# EAGLE schematic pihat (EAGLE 7.6.0)
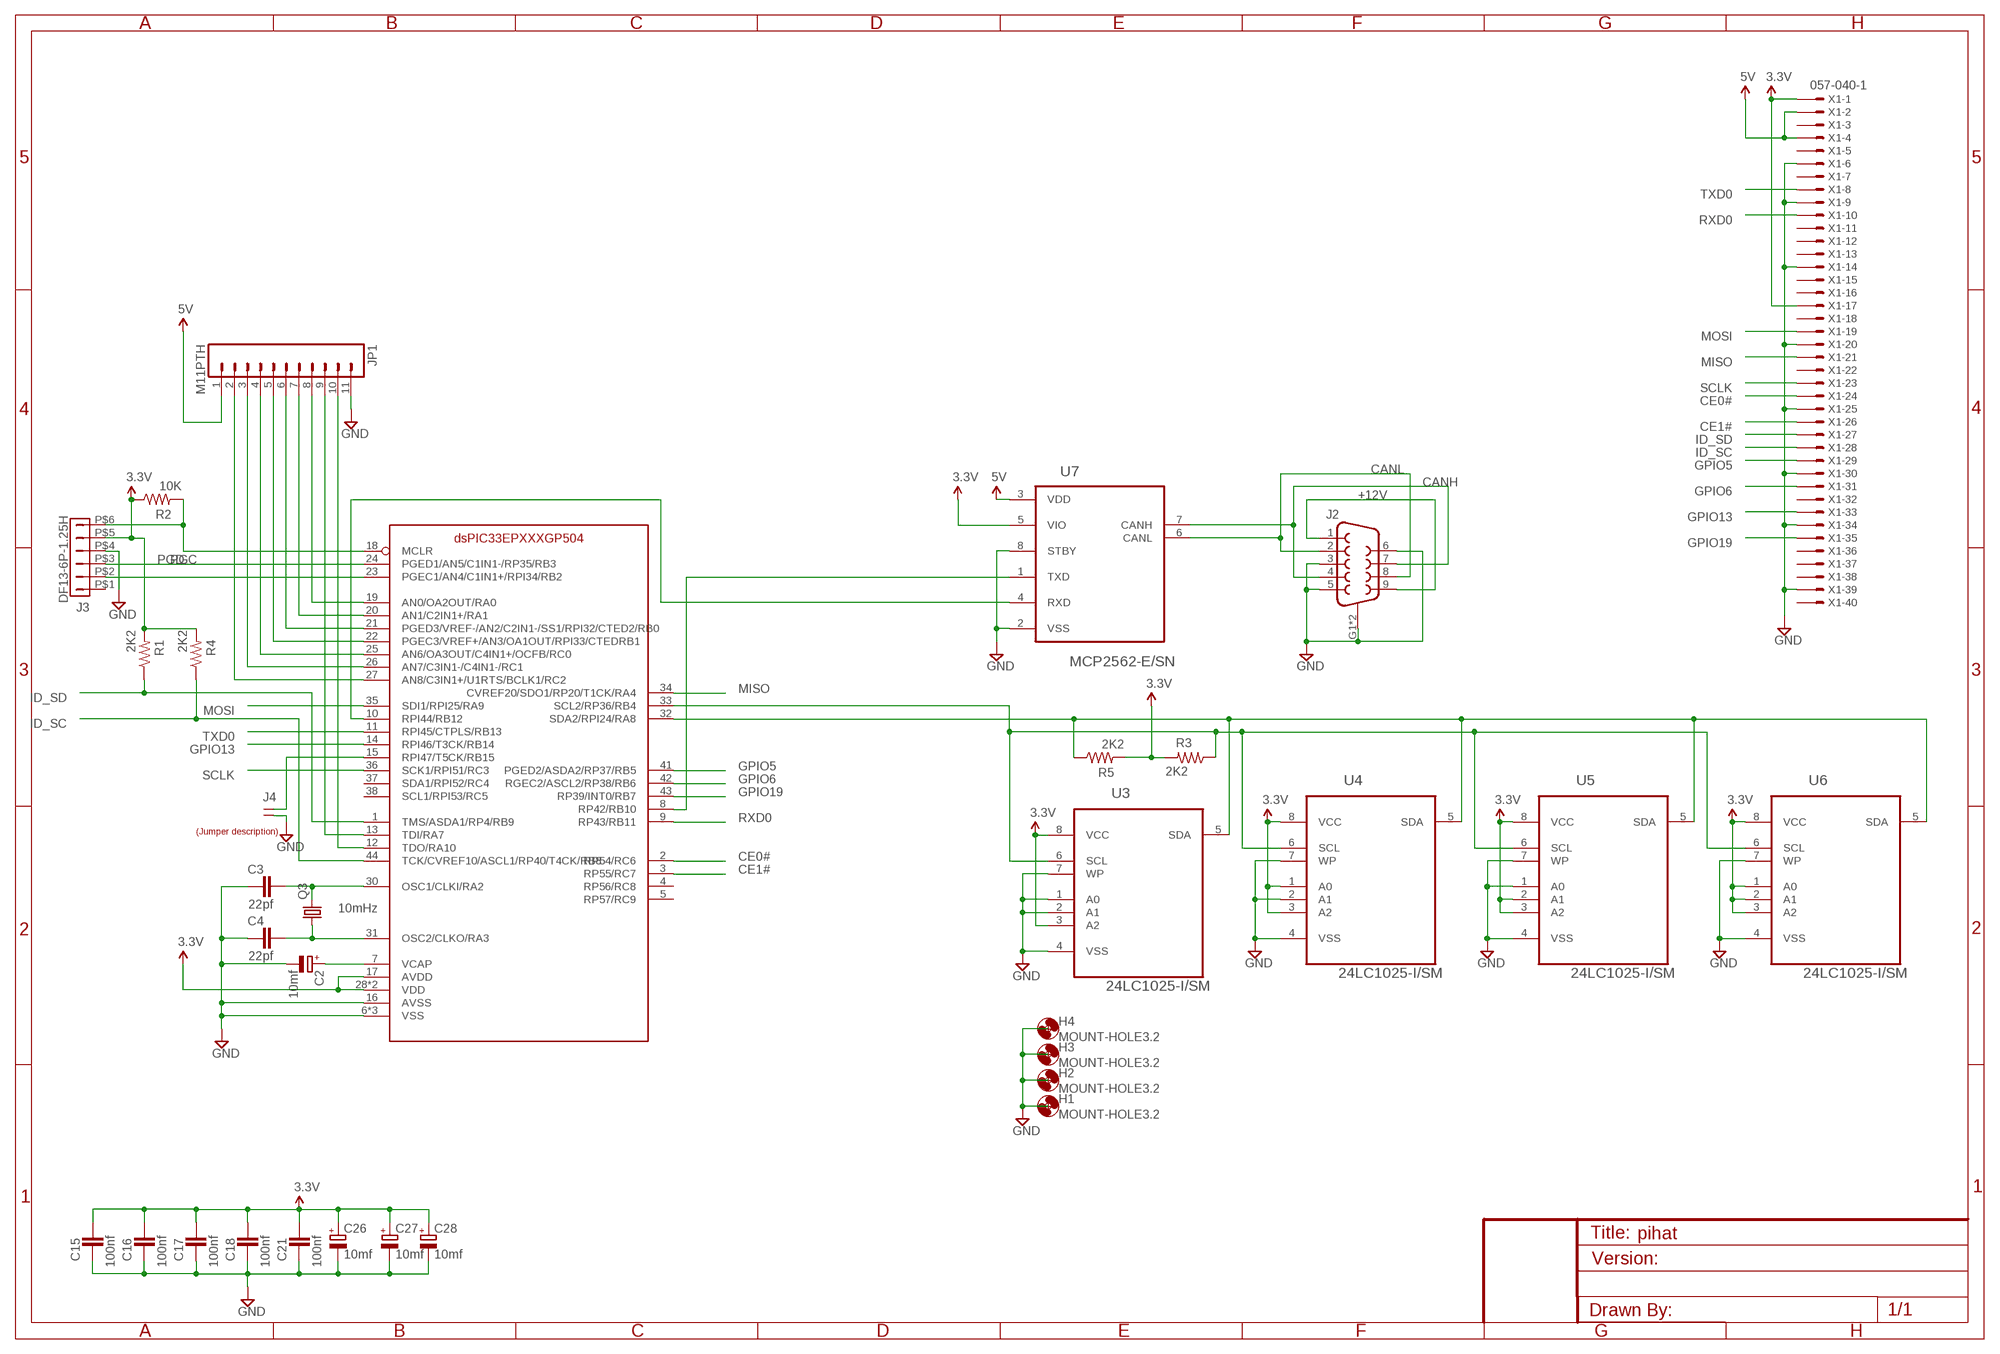
[diagram p0: schematic, sheet 1]

## Parts
C2  10mf  CAPACITOR_POL-SMC_A  [SMC_A]
C3  22pf  CAPACITOR_NPOL-0805  [C805]
C4  22pf  CAPACITOR_NPOL-0805  [C805]
C15  100nf  CAPACITOR_NPOL-0805  [C805]
C16  100nf  CAPACITOR_NPOL-0805  [C805]
C17  100nf  CAPACITOR_NPOL-0805  [C805]
C18  100nf  CAPACITOR_NPOL-0805  [C805]
C21  100nf  CAPACITOR_NPOL-0805  [C805]
C26  10mf  CAPACITOR_POL-SMC_A  [SMC_A]
C27  10mf  CAPACITOR_POL-SMC_A  [SMC_A]
C28  10mf  CAPACITOR_POL-SMC_A  [SMC_A]
H1  MOUNT-HOLE3.2  [3,2]
H2  MOUNT-HOLE3.2  [3,2]
H3  MOUNT-HOLE3.2  [3,2]
H4  MOUNT-HOLE3.2  [3,2]
J2  DB9FEMALE  [DB9]
J3  DF13-6P-1.25H  [DF13A-6P-1.25H]
J4  JUMPER-1X2  [JUMPER-1X2]
JP1  M11PTH  [1X11]
Q3  10mHz  CRYSTALHC49S  [HC49/S]
R1  2K2  RESISTOR0603-RES  [0603-RES]
R2  10K  RESISTOR0603-RES  [0603-RES]
R3  2K2  RESISTOR0603-RES  [0603-RES]
R4  2K2  RESISTOR0603-RES  [0603-RES]
R5  2K2  RESISTOR0603-RES  [0603-RES]
U1  DSPIC33EPXXXGP504  [TQFP44]
U3  24LC1025-I/SM  [SOIC8-N_MC]
U4  24LC1025-I/SM  [SOIC8-N_MC]
U5  24LC1025-I/SM  [SOIC8-N_MC]
U6  24LC1025-I/SM  [SOIC8-N_MC]
U7  MCP2562-E/SN  [SOIC-8N]
U$1  LABEL_JUMPER_1X2  [JUMP2_DESC]
X1  057-040-1  [057-040-1]

## Nets
3.3V: C15.1 C16.1 C17.1 C18.1 C21.1 C26.+ C27.+ C28.+ J3.P$5 R1.2 R2.1 R3.2 R4.2 R5.2 U1.17(AVDD) U1.28(VDD) U1.40(VDD) U3.3(A2) U3.8(VCC) U4.1(A0) U4.3(A2) U4.8(VCC) U5.2(A1) U5.3(A2) U5.8(VCC) U6.1(A0) U6.2(A1) U6.3(A2) U6.8(VCC) U7.5(VIO) X1.1 X1.17
5V: JP1.1 U7.3(VDD) X1.2 X1.4
!MCLR: J3.P$6 R2.2 U1.18(MCLR)
+12V [12v]: J2.1 J2.9
CANH: J2.4 J2.7 U7.7(CANH)
CANL: J2.2 J2.8 U7.6(CANL)
CE0#: U1.2(RP54/RC6) X1.24
CE1#: U1.3(RP55/RC7) X1.26
GND: C2.- C3.2 C4.2 C15.2 C16.2 C17.2 C18.2 C21.2 C26.- C27.- C28.- J2.3 J2.5 J2.6 J2.G1(SHIELD) J2.G2(SHIELD) J3.P$4 J4.2 JP1.11 U1.6(VSS) U1.16(AVSS) U1.29(VSS) U1.39(VSS) U3.1(A0) U3.2(A1) U3.4(VSS) U3.7(WP) U4.2(A1) U4.4(VSS) U4.7(WP) U5.1(A0) U5.4(VSS) U5.7(WP) U6.4(VSS) U6.7(WP) U7.2(VSS) U7.8(STBY) X1.6 X1.9 X1.14 X1.20 X1.25 X1.30 X1.34 X1.39
GPIO5: U1.41(PGED2/ASDA2/RP37/RB5) X1.29
GPIO6: U1.42(RGEC2/ASCL2/RP38/RB6) X1.31
GPIO13: U1.14(RPI46/T3CK/RB14) X1.33
GPIO19: U1.43(RP39/INT0/RB7) X1.35
ID_SC: R4.1 U1.44(TCK/CVREF10/ASCL1/RP40/T4CK/RB8) X1.28
ID_SD: R1.1 U1.1(TMS/ASDA1/RP4/RB9) X1.27
MISO: U1.34(CVREF20/SDO1/RP20/T1CK/RA4) X1.21
MOSI: U1.35(SDI1/RPI25/RA9) X1.19
N$1: JP1.10 U1.12(TDO/RA10)
N$2: JP1.9 U1.13(TDI/RA7)
N$3: JP1.8 U1.19(AN0/OA2OUT/RA0)
N$4: JP1.7 U1.20(AN1/C2IN1+/RA1)
N$5: JP1.6 U1.21(PGED3/VREF-/AN2/C2IN1-/SS1/RPI32/CTED2/RB0)
N$6: JP1.5 U1.22(PGEC3/VREF+/AN3/OA1OUT/RPI33/CTEDRB1)
N$7: JP1.4 U1.25(AN6/OA3OUT/C4IN1+/OCFB/RC0)
N$8: JP1.3 U1.26(AN7/C3IN1-/C4IN1-/RC1)
N$9: JP1.2 U1.27(AN8/C3IN1+/U1RTS/BCLK1/RC2)
N$19: C3.1 Q3.2 U1.30(OSC1/CLKI/RA2)
N$24: U1.10(RPI44/RB12) U7.4(RXD)
N$25: C2.+ U1.7(VCAP)
N$26: U1.8(RP42/RB10) U7.1(TXD)
N$70: C4.1 Q3.1 U1.31(OSC2/CLKO/RA3)
PGC: J3.P$2 U1.23(PGEC1/AN4/C1IN1+/RPI34/RB2)
PGD: J3.P$3 U1.24(PGED1/AN5/C1IN1-/RP35/RB3)
RESET#: J4.1 U1.15(RPI47/T5CK/RB15)
RXD0: U1.9(RP43/RB11) X1.10
SCL: R3.1 U1.33(SCL2/RP36/RB4) U3.6(SCL) U4.6(SCL) U5.6(SCL) U6.6(SCL)
SCLK: U1.36(SCK1/RPI51/RC3) X1.23
SDA: R5.1 U1.32(SDA2/RPI24/RA8) U3.5(SDA) U4.5(SDA) U5.5(SDA) U6.5(SDA)
TXD0: U1.11(RPI45/CTPLS/RB13) X1.8
Unconnected: J3.P$1 U1.4(RP56/RC8) U1.5(RP57/RC9) U1.37(SDA1/RPI52/RC4) U1.38(SCL1/RPI53/RC5) X1.3 X1.5 X1.7 X1.11 X1.12 X1.13 X1.15 X1.16 X1.18 X1.22 X1.32 X1.36 X1.37 X1.38 X1.40

## Library data of the parts
C2 C26-C28 = dp_devices:CAPACITOR_POL: Polarized capacitor in various packages; PARTNO: T491A106K004AT
C3 C4 = dp_devices:CAPACITOR_NPOL: Non-Polarized capacitor in various packages; PARTNO: C0805C220J5GACTU
C15-C18 C21 = dp_devices:CAPACITOR_NPOL: Non-Polarized capacitor in various packages; PARTNO: CL21F104ZBCNNNC
H1-H4 = holes:MOUNT-HOLE: MOUNTING HOLE with drill center marker
J2 = 15pinD:DB9: DB9 Connector Standard DB9 (D-Sub 9) serial connector. Can be used for CAN bus as well as RS485 and RS232. Footprint production proven. Spark Fun Electronics SKU : PRT-00429; PARTNO: 1734354-2; PROD_ID: CONN-08194
J3 = con-hirose-df13:DF13-6P-1.25: DF13-6P 1.25mm Pitch Miniature Crimping Connector.; PARTNO: DF13A-6P-1.25H(20)
J4 = QuantumOptics:JUMPER-1X2: Jumper, header, SIP on 0.1" grid, for option selection.; PARTNO: M20-9770246
JP1 = 15pinD:M11: Header 11 Standard 11-pin 0.1" header. Use with straight break away headers (SKU : PRT-00116), right angle break away headers (PRT-00553), swiss pins (PRT-00743), machine pins (PRT-00117), and female headers (PRT-00115).
Q3 = crystal:CRYSTAL: CRYSTAL; OC_FARNELL: 1667008; OC_NEWARK: unknown; PARTNO: ATS100B-E
R1 R3-R5 = SparkFun-Passives:RESISTOR: Resistor Basic schematic elements and footprints for 0603, 1206, and PTH resistors.; PARTNO: RC0603FR-072K2L
R2 = SparkFun-Passives:RESISTOR: Resistor Basic schematic elements and footprints for 0603, 1206, and PTH resistors.; PARTNO: RC0603FR-0710KL
U1 = microchip-dspic:DSPIC33EPXXXGP504; PARTNO: DSPIC33EP512GP504-I/PT
U3-U6 = Microchip_By_element14_Batch_1:24LC1025-I/SM: 1024K I2C CMOS Serial EEPROM; PARTNO: 24LC1025T-I/SN
U7 = Microchip-MCP2562-E_SN:MCP2562-E/SN: High-Speed CAN Transceiver,SOIC-8; PARTNO: MCP2562-E/SN
U$1 = dp_devices:LABEL_JUMPER_1X2: Nice formatted two legged jumperdescription Use attributes to change the values ON = With jumper OFF = Without jumper; OFF: Normal; ON: Reset
X1 = con-panduit-changed:057-040-: CONNECTOR 40-pin series 057 contact pc board low profile headers; OC_FARNELL: unknown; OC_NEWARK: unknown

## Net classes
2 12v: width 0.152 mm, drill 0.305 mm, clearance 0.305 mm